# EAGLE design Full_Pow_Schematic1.sch (EAGLE 9.6.2)
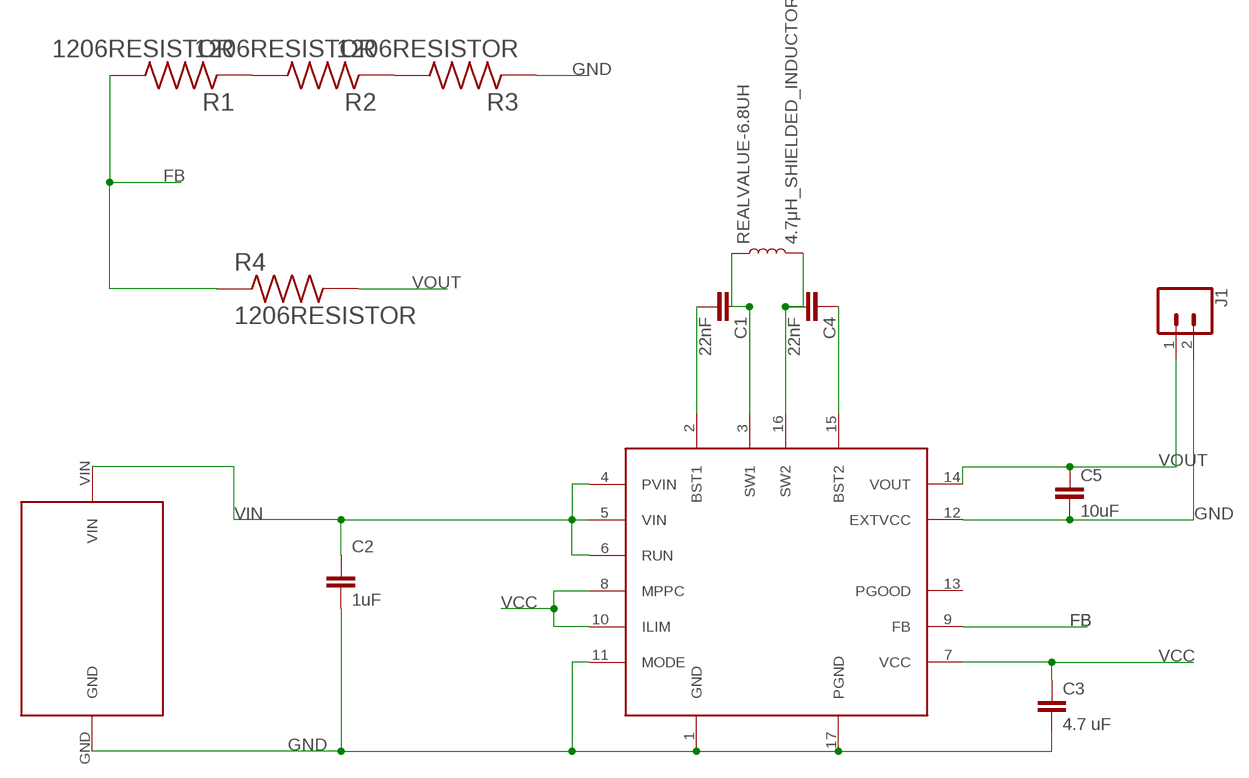
[diagram p0: schematic, sheet 1]

## Parts
C1  22nF  22NF/22,000PF-0603-25V-10%-X7R  [0402]
C2  1uF  22NF/22,000PF-0603-25V-10%-X7R  [0402]
C3  4.7 uF  22NF/22,000PF-0603-25V-10%-X7R  [0402]
C4  22nF  22NF/22,000PF-0603-25V-10%-X7R  [0402]
C5  10uF  22NF/22,000PF-0603-25V-10%-X7R  [0402]
J1  CONN_02  [1X02]
R1  1206RESISTOR  [RESC3116X65N]
R2  1206RESISTOR  [RESC3116X65N]
R3  1206RESISTOR  [RESC3116X65N]
R4  1206RESISTOR  [RESC3116X65N]
REALVALUE-6.8UH  4.7μH_SHIELDED_INDUCTOR  [1008(2520)]
U$1  LTC3130  [SOP50P490X110-17N]
U$2  SM101K12L  [SM101K12L]

## Nets
BST1: C1.2 U$1.2(BST1)
BST2: C4.1 U$1.15(BST2)
FB: R1.2 R4.1 U$1.9(FB)
GND: C2.2 C3.2 C5.2 J1.2 R3.1 U$1.1(GND) U$1.11(MODE) U$1.12(EXTVCC) U$1.17(PGND) U$2.GND
N$3: R1.1 R2.2
N$6: R2.1 R3.2
SW1: C1.1 REALVALUE-6.8UH.1 U$1.3(SW1)
SW2: C4.2 REALVALUE-6.8UH.2 U$1.16(SW2)
VCC: C3.1 U$1.7(VCC) U$1.8(MPPC) U$1.10(ILIM)
VIN: C2.1 U$1.4(PVIN) U$1.5(VIN) U$1.6(RUN) U$2.VIN
VOUT: C5.1 J1.1 R4.2 U$1.14(VOUT)
Unconnected: U$1.13(PGOOD)

## Library data of the parts
C1 C4 = SparkFun-Capacitors:22NF/22,000PF: 0.022uF/22nF/22,000pF ceramic capacitors A capacitor is a passive two-terminal electrical component used to store electrical energy temporarily in an electric field.; PROD_ID: CAP-15062
C2 C3 C5 = SparkFun-Capacitors:22NF/22,000PF: 0.022uF/22nF/22,000pF ceramic capacitors A capacitor is a passive two-terminal electrical component used to store electrical energy temporarily in an electric field.; PROD_ID: CAP-15062; VALUE: 22nF
J1 = SparkFun-Connectors:CONN_02: Multi connection point. Often used as Generic Header-pin footprint for 0.1 inch spaced/style header connections On any of the 0.1 inch spaced packages, you can populate with these: Break Away Headers - Straight <https://www.sparkfun.com/products/116> (PRT-00116) Break Away Male Headers - Right Angle <https://www.sparkfun.com/products/553> (PRT-00553) Female Headers <https://www.sparkfun.com/products/115> (PRT-00115) Break Away Headers - Machine Pin <https://www.sparkfun.com/products/117> (PRT-00117) Break Away Female Headers - Swiss Machine Pin <https://www.sparkfun.com/products/743> (PRT-00743) For SCREWTERMINALS and SPRING TERMINALS visit here: Screw Terimnals on SparkFun.com <https://www.sparkfun.com/search/results?term=Screw+Terminals> (5mm/3.5mm/2.54mm spacing) This device is also useful as a general connection point to wire up your design to another part of your project. Our various solder wires solder well into these plated through hole pads. Hook-Up Wire - Assortment (Stranded, 22 AWG) <https://www.sparkfun.com/products/11375> (PRT-11375) Hook-Up Wire - Assortment (Solid Core, 22 AWG) <https://www.sparkfun.com/products/11367> (PRT-11367) View the entire wire category on our website here <https://www.sparkfun.com/categories/141> Special notes: Molex polarized connector foot print use with: PRT-08233 with associated crimp pins and housings. 2.54_SCREWTERM for use with PRT-10571. 3.5mm Screw Terminal footprints for PRT-08084 5mm Screw Terminal footprints for use with PRT-08432
R1-R4 = Lib1:1206RESISTOR: Res Thick Film 1206 13 Ohm 5% 1/4W ±100ppm/°C Molded SMD Paper T/R Check availability <https://pricing.snapeda.com/parts/RC1206JR-0713RL/Yageo/view-part?ref=eda>; AVAILABILITY: In Stock; DESCRIPTION: 13 Ohms ±5% 0.25W, 1/4W Chip Resistor 1206 (3216 Metric) Moisture Resistant Thick Film; MF: Yageo; MP: RC1206JR-0713RL; PACKAGE: 3116 Yageo; PRICE: None; PURCHASE-URL: https://pricing.snapeda.com/search/part/RC1206JR-0713RL/?ref=eda
REALVALUE-6.8UH = SparkFun-Coils:4.7μH_SHIELDED_INDUCTOR: 4.7uH Inductor 4.7uH 1.4A 50mOhm 1008(2520) Package Shielded; PROD_ID: NDUC-14880
U$1 = Pow_lib:LTC3130
U$2 = Lib1:SM101K12L

## Board
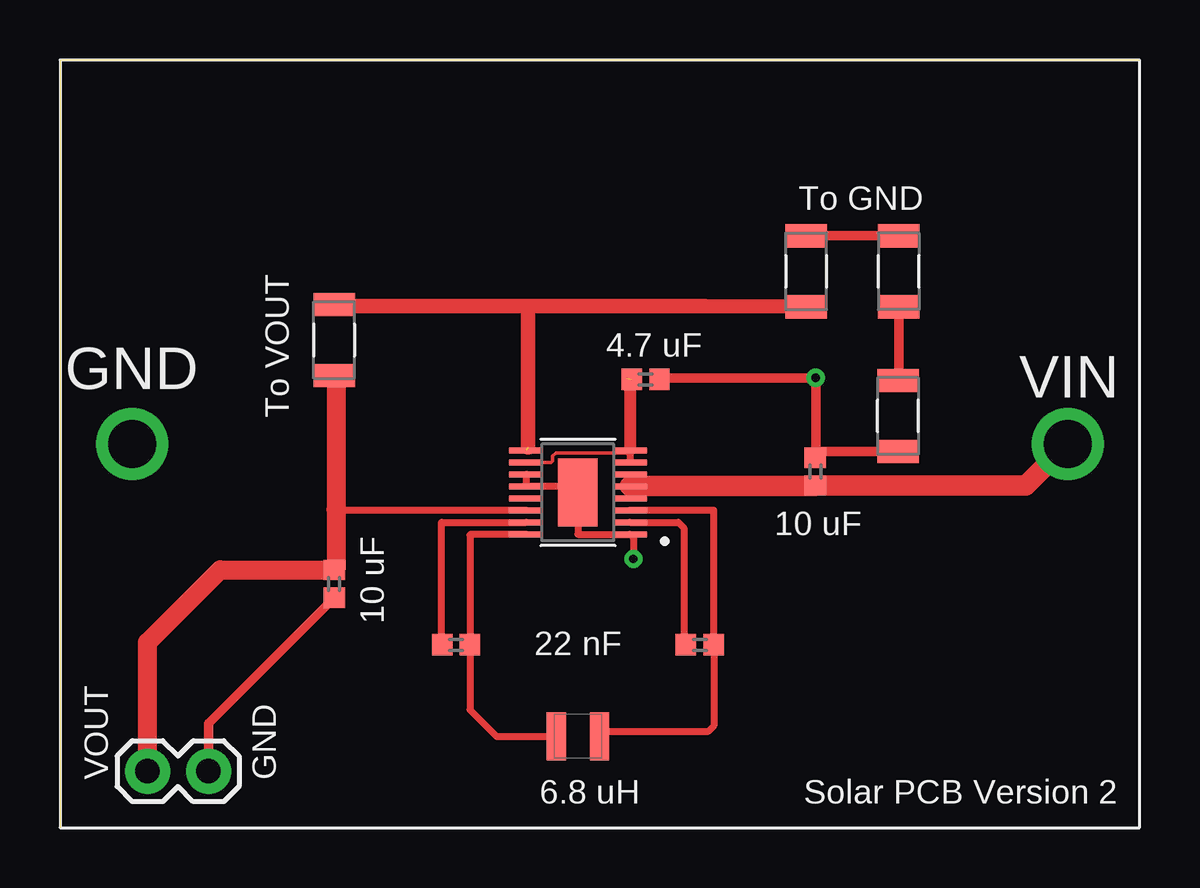
[diagram p1: board, top side]
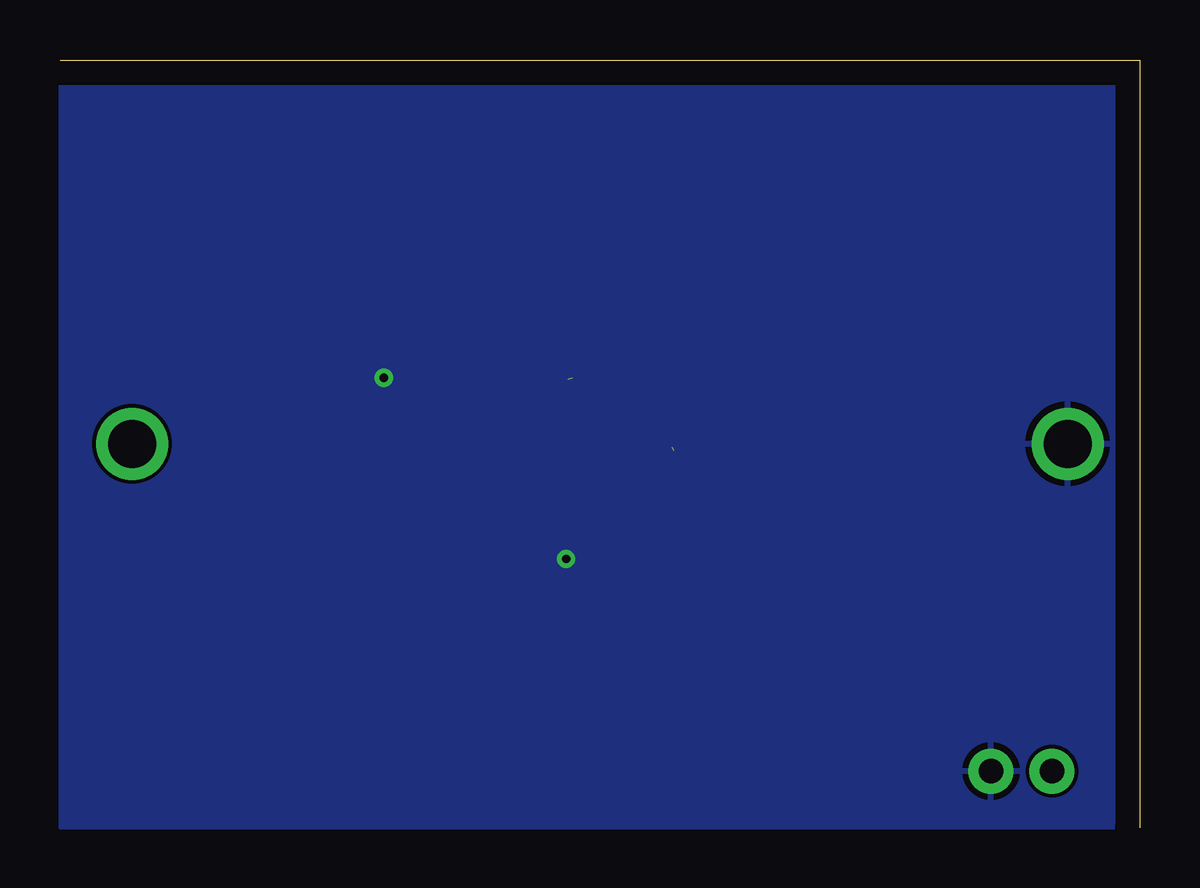
[diagram p2: board, bottom side, seen from below]

Size 45 x 32 mm. Coordinates in mm from the lower left corner, seen from the top.
Outline: 45,32 0,32 0,0
Copper layers (1*16): Top 0.035mm / dielectric 1.5mm / Bottom 0.035mm
Design rules "default": minimum track width 6mil, minimum drill 0.35mm, track to track 6mil, track to pad 6mil, pad to pad 6mil, via to via 6mil, smd to smd 6mil, copper to edge 40mil, drill to drill 6mil, minimum pad ring 10mil, minimum via ring 8mil, stop-mask expansion 4mil, vias tented up to drill 0mil, thermal gap 10mil

### Footprints (pad centres in the part's own frame; a part is rotated, then mirrored left to right if it is on the bottom)
0402 = smd 0.85 x 0.9: 1 -0.58,0; 2 0.58,0
1X02 = drill 1.016 pad 1.88: 1 0,0; 2 2.54,0
RESC3116X65N = smd 0.97 x 1.73: 1 -1.48,0; 2 1.48,0
1008(2520) = smd 0.8 x 2: 1 -0.9,0; 2 0.9,0
SOP50P490X110-17N = smd 1.45 x 0.28: 1 -2.16,1.75; 2 -2.16,1.25; 3 -2.16,0.75; 4 -2.16,0.25; 5 -2.16,-0.25; 6 -2.16,-0.75; 7 -2.16,-1.25; 8 -2.16,-1.75; 9 2.16,-1.75; 10 2.16,-1.25; 11 2.16,-0.75; 12 2.16,-0.25; 13 2.16,0.25; 14 2.16,0.75; 15 2.16,1.25; 16 2.16,1.75 | smd 1.651 x 2.845: 17 0,0
SM101K12L = drill 2 pad 3: GND 3,16; VIN 42,16

### Placement (x,y rotation side)
C1  26.67,7.62 180 top
C2  31.48,14.84 90 top
C3  24.41,18.68 0 top
C4  16.51,7.62 0 top
C5  11.43,10.16 270 top
J1  3.65,2.35 0 top
R1  31.1,23.19 270 top
R2  34.96,23.19 90 top
R3  34.93,17.16 90 top
R4  11.43,20.32 270 top
REALVALUE-6.8UH  21.59,3.81 180 top
U$1  21.59,13.97 180 top
U$2  0,0 0 top

### Tracks (layer width: path | path; a pad name or v marks a point on that pad's centre or on a via)
BST1
  Top 0.152: 26,7.75 C1.2 | 23.75,12.75 U$1.2
  Top 0.3: U$1.2 25.78,12.72 26,12.5 26,7.75
BST2
  Top 0.152: C4.1 15.9,7.65
  Top 0.3: 15.9,7.65 15.9,12.7 15.92,12.72 U$1.15
FB  (1 unrouted)
  Top 0.152: 19.25,15.75 U$1.9 | R4.1 11.5,21.75
  Top 0.6: 19.5,15.85 19.5,21.7 | 19.5,21.7 19.5,21.75 26.88,21.75 R1.2 | 19.5,21.7 19.45,21.75 11.5,21.75
GND  (via drill 0.35)
  Top 0.152: 21.5,14.22 21.5,14 U$1.17 | C3.2 25.06,18.75 | C2.2 31.5,15.44 | U$1.1 23.9,12.07
  Top 0.3: U$1.17 21.59,12.22 U$1.1 | 21.5,14.22 U$1.12 U$1.11 | 23.9,12.07 v23.9,11.2
  Top 0.4: 25.06,18.75 v31.5,18.75 31.5,15.68 | 31.5,15.44 31.5,15.68 | C5.2 6.19,4.34 J1.2 | R3.1 31.5,15.68
  pour Bottom: 0,0 45,0 45,32 0,32
N$3
  Top 0.4: R2.2 R1.1
N$6
  Top 0.152: 34.96,18.67 R3.2
  Top 0.4: R2.1 34.96,18.67
SW1
  Top 0.152: 27.25,7.5 C1.1 | 22.5,4 REALVALUE-6.8UH.1
  Top 0.3: U$1.3 27.25,13.22 C1.1 27.25,4.25 27,4 22.5,4
SW2
  Top 0.152: REALVALUE-6.8UH.2
  Top 0.3: U$1.16 17.12,12.22 17.09,12.19 C4.2 17.09,4.91 18.2,3.8 REALVALUE-6.8UH.2
VCC  (1 unrouted)
  Top 0.152: 19.5,15.25 U$1.10 20.46,15.22 20.47,15.21 20.54,15.28 20.54,15.49 20.67,15.62 23.65,15.62 U$1.8 | 23.63,18.75 23.75,18.75
  Top 0.3: U$1.8 U$1.7
  Top 0.5: 23.75,18.75 U$1.8
VIN
  Top 0.152: U$1.5 U$1.4 | U$1.5 U$1.6 23.75,14.75 | 23.75,14.25 U$1.5
  Top 0.77: C2.1
  Top 0.85: C2.1 23.75,14.25 | C2.1 40,14.26 40.26,14.26 U$2.VIN
VOUT
  Top 0.152: 11.5,10.75 C5.1 11.25,10.75 | 11.5,18.75 R4.2 | 19.25,13.25 U$1.14 | 11.53,13.22 11.5,13.25
  Top 0.3: U$1.14 11.53,13.22
  Top 0.8: 11.5,18.75 11.5,13.25 11.5,10.75 6.68,10.75 3.65,7.72 J1.1

### Text on the board
tNames: To GND | To VOUT | GND | 4.7 uF | VIN | 10 uF | 10 uF | 22 nF | VOUT | GND | 6.8 uH | Solar PCB Version 2